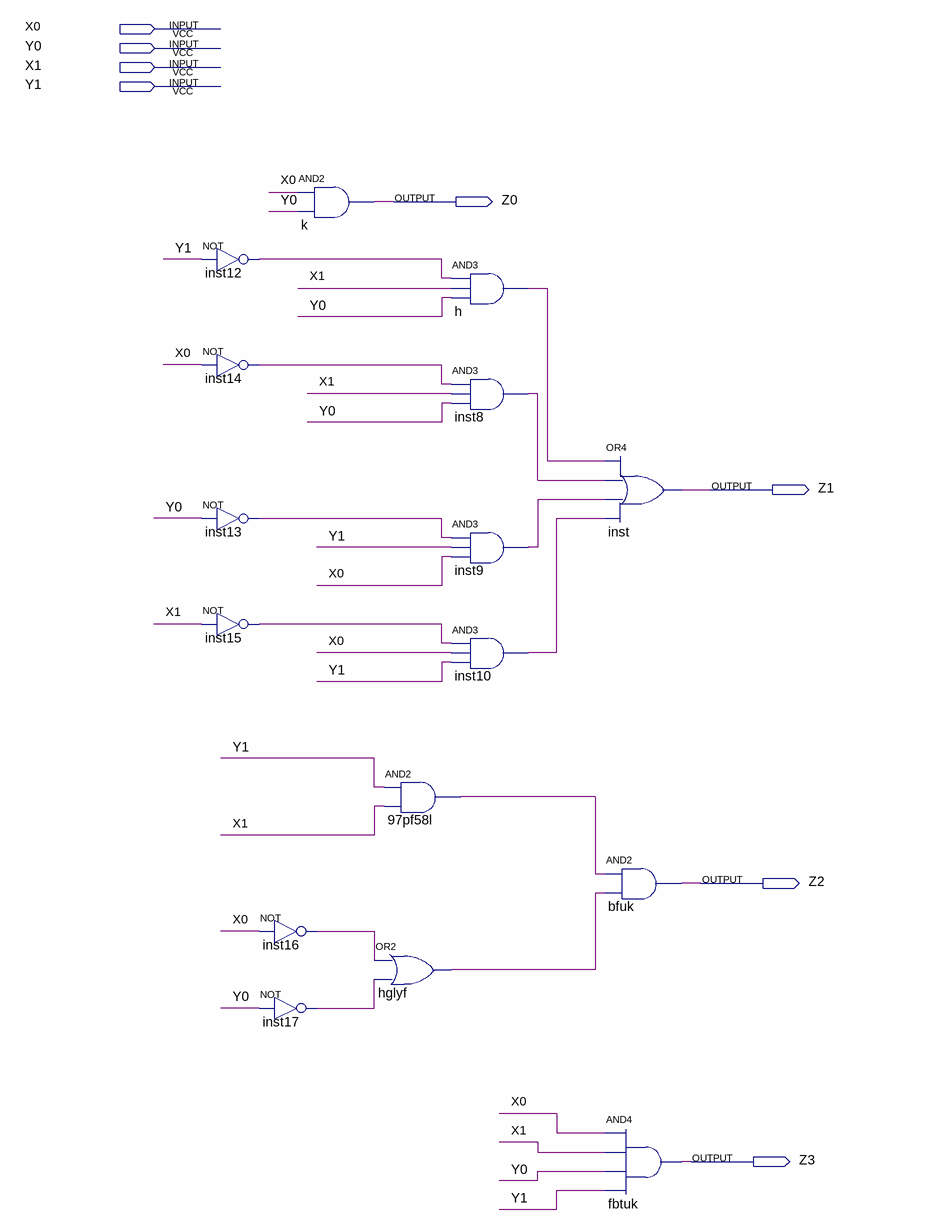
[diagram p0: schematic sheet]
// Quartus schematic MultiplUwUador.bdf as structural Verilog: 16 symbols, 8 pins
module MultiplUwUador (
  input  X0,
  input  Y0,
  input  X1,
  input  Y1,
  output Z0,
  output Z1,
  output Z2,
  output Z3
);

  wire h_out, hglyf_out, inst8_out, inst9_out, inst10_out, inst12_out, inst13_out, inst14_out, inst15_out,
       inst16_out, inst17_out, n97pf58l_out;

  not inst12 (inst12_out, Y1);
  not inst14 (inst14_out, X0);
  not inst13 (inst13_out, Y0);
  not inst15 (inst15_out, X1);
  and k (Z0, X0, Y0);
  not inst16 (inst16_out, X0);
  not inst17 (inst17_out, Y0);
  and u_97pf58l (n97pf58l_out, Y1, X1);
  or hglyf (hglyf_out, inst16_out, inst17_out);
  and h (h_out, inst12_out, X1, Y0);
  and inst8 (inst8_out, inst14_out, X1, Y0);
  and inst9 (inst9_out, inst13_out, Y1, X0);
  and inst10 (inst10_out, inst15_out, X0, Y1);
  or inst (Z1, h_out, inst8_out, inst9_out, inst10_out);
  and bfuk (Z2, n97pf58l_out, hglyf_out);
  and fbtuk (Z3, X0, X1, Y0, Y1);
endmodule
